# Altium schematic sheet driver2.SchDoc
size OrCAD D
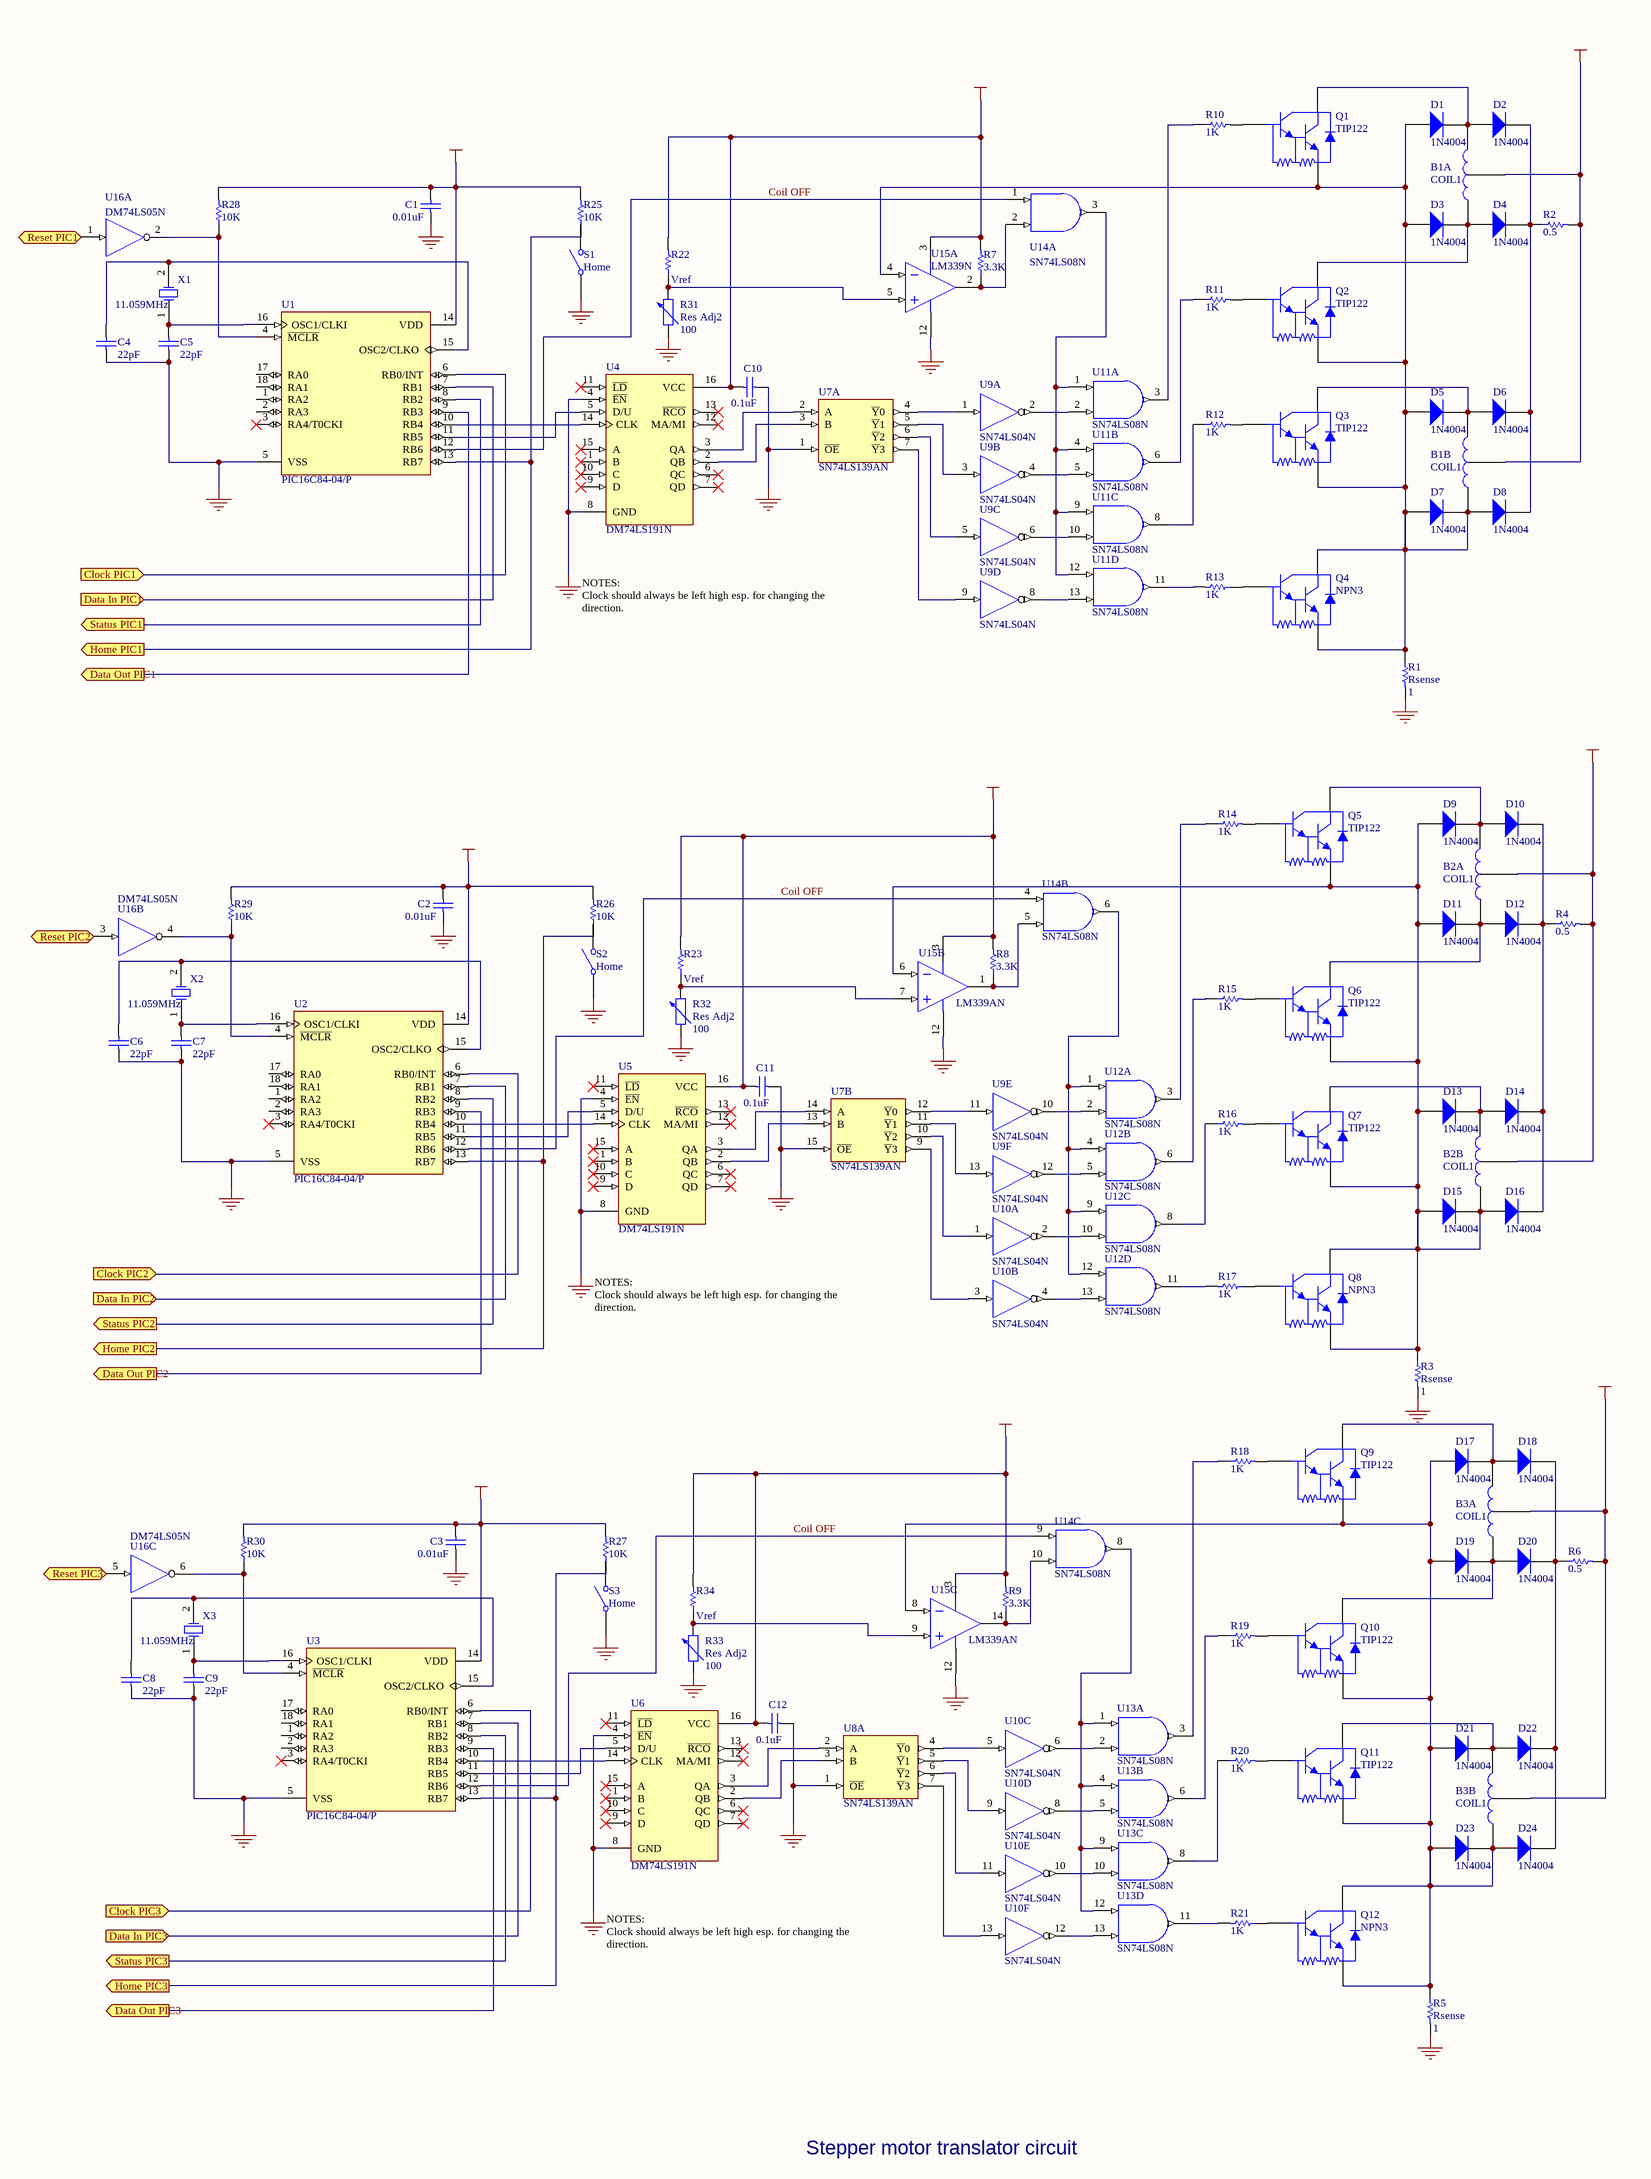
[diagram p0: driver2.SchDoc]

## Parts
(Parts that share a designator on the sheet are numbered #1, #2 ... from top to bottom, then left to right.)
B1A  COIL1
B1B  COIL1
B2A  COIL1
B2B  COIL1
B3A  COIL1
B3B  COIL1
C1  value 0.01uF  [DIP-18]  (hidden comment: PIC16C84-04/P)
C2  value 0.01uF  [DIP-18]  (hidden comment: PIC16C84-04/P)
C3  value 0.01uF  [DIP-18]  (hidden comment: PIC16C84-04/P)
C4  value 22pF  [BCY-W2/D3.1]  (hidden comment: XTAL)
C5  value 22pF  [BCY-W2/D3.1]  (hidden comment: XTAL)
C6  value 22pF  [BCY-W2/D3.1]  (hidden comment: XTAL)
C7  value 22pF  [BCY-W2/D3.1]  (hidden comment: XTAL)
C8  value 22pF  [BCY-W2/D3.1]  (hidden comment: XTAL)
C9  value 22pF  [BCY-W2/D3.1]  (hidden comment: XTAL)
C10  value 0.1uF  [DIP-14/D19.7]  (hidden comment: SN74LS08N)
C11  value 0.1uF  [DIP-14/D19.7]  (hidden comment: SN74LS08N)
C12  value 0.1uF  [DIP-14/D19.7]  (hidden comment: SN74LS08N)
D1  1N4004  [DIO10.46-5.3x2.8]
D2  1N4004  [DIO10.46-5.3x2.8]
D3  1N4004  [DIO10.46-5.3x2.8]
D4  1N4004  [DIO10.46-5.3x2.8]
D5  1N4004  [DIO10.46-5.3x2.8]
D6  1N4004  [DIO10.46-5.3x2.8]
D7  1N4004  [DIO10.46-5.3x2.8]
D8  1N4004  [DIO10.46-5.3x2.8]
D9  1N4004  [DIO10.46-5.3x2.8]
D10  1N4004  [DIO10.46-5.3x2.8]
D11  1N4004  [DIO10.46-5.3x2.8]
D12  1N4004  [DIO10.46-5.3x2.8]
D13  1N4004  [DIO10.46-5.3x2.8]
D14  1N4004  [DIO10.46-5.3x2.8]
D15  1N4004  [DIO10.46-5.3x2.8]
D16  1N4004  [DIO10.46-5.3x2.8]
D17  1N4004  [DIO10.46-5.3x2.8]
D18  1N4004  [DIO10.46-5.3x2.8]
D19  1N4004  [DIO10.46-5.3x2.8]
D20  1N4004  [DIO10.46-5.3x2.8]
D21  1N4004  [DIO10.46-5.3x2.8]
D22  1N4004  [DIO10.46-5.3x2.8]
D23  1N4004  [DIO10.46-5.3x2.8]
D24  1N4004  [DIO10.46-5.3x2.8]
Q1  TIP122  [BCY-W3]
Q2  TIP122  [BCY-W3]
Q3  TIP122  [BCY-W3]
Q4  NPN3  [BCY-W3]
Q5  TIP122  [BCY-W3]
Q6  TIP122  [BCY-W3]
Q7  TIP122  [BCY-W3]
Q8  NPN3  [BCY-W3]
Q9  TIP122  [BCY-W3]
Q10  TIP122  [BCY-W3]
Q11  TIP122  [BCY-W3]
Q12  NPN3  [BCY-W3]
R1  Rsense  value 1  [DIO10.46-5.3x2.8]
R2  value 0.5  [DIO10.46-5.3x2.8]  (hidden comment: 1N4004)
R3  Rsense  value 1  [DIO10.46-5.3x2.8]
R4  value 0.5  [DIO10.46-5.3x2.8]  (hidden comment: 1N4004)
R5  Rsense  value 1  [DIO10.46-5.3x2.8]
R6  value 0.5  [DIO10.46-5.3x2.8]  (hidden comment: 1N4004)
R7  value 3.3K  [BCY-W3]  (hidden comment: NPN3)
R8  value 3.3K  [BCY-W3]  (hidden comment: NPN3)
R9  value 3.3K  [BCY-W3]  (hidden comment: NPN3)
R10  1K  [AXIAL-0.3]
R11  value 1K  [BCY-W3]  (hidden comment: NPN3)
R12  value 1K  [BCY-W3]  (hidden comment: NPN3)
R13  value 1K  [BCY-W3]  (hidden comment: NPN3)
R14  1K  [AXIAL-0.3]
R15  value 1K  [BCY-W3]  (hidden comment: NPN3)
R16  value 1K  [BCY-W3]  (hidden comment: NPN3)
R17  value 1K  [BCY-W3]  (hidden comment: NPN3)
R18  1K  [AXIAL-0.3]
R19  value 1K  [BCY-W3]  (hidden comment: NPN3)
R20  value 1K  [BCY-W3]  (hidden comment: NPN3)
R21  value 1K  [BCY-W3]  (hidden comment: NPN3)
R22  value Vref  [SO-G14/E2]  (hidden comment: DM74LS05M)
R23  value Vref  [SO-G14/E2]  (hidden comment: DM74LS05M)
R25  value 10K  [SPST-2]  (hidden comment: SW-SPST)
R26  value 10K  [SPST-2]  (hidden comment: SW-SPST)
R27  value 10K  [SPST-2]  (hidden comment: SW-SPST)
R28  value 10K  [DIP-18]  (hidden comment: PIC16C84-04/P)
R29  value 10K  [DIP-18]  (hidden comment: PIC16C84-04/P)
R30  value 10K  [DIP-18]  (hidden comment: PIC16C84-04/P)
R31  Res Adj2  value 100  [AXIAL-0.6]
R32  Res Adj2  value 100  [AXIAL-0.6]
R33  Res Adj2  value 100  [AXIAL-0.6]
R34  value Vref  [SO-G14/E2]  (hidden comment: DM74LS05M)
S1  Home  [SPST-2]
S2  Home  [SPST-2]
S3  Home  [SPST-2]
U1  PIC16C84-04/P  [DIP-18]
U2  PIC16C84-04/P  [DIP-18]
U3  PIC16C84-04/P  [DIP-18]
U4  DM74LS191N  [DIP-16]
U5  DM74LS191N  [DIP-16]
U6  DM74LS191N  [DIP-16]
U7  SN74LS139AN  [DIP-16/X1.5]  (parts A,B of 2)
U8  SN74LS139AN  [DIP-16/X1.5]  (part A of 2)
U9  SN74LS04N  [DIP-14/D19.7]  (parts A,B,C,D,E,F of 6)
U10  SN74LS04N  [DIP-14/D19.7]  (parts A,B,C,D,E,F of 6)
U11  SN74LS08N  [DIP-14/D19.7]  (parts A,B,C,D of 4)
U12  SN74LS08N  [DIP-14/D19.7]  (parts A,B,C,D of 4)
U13  SN74LS08N  [DIP-14/D19.7]  (parts A,B,C,D of 4)
U14  SN74LS08N  [DIP-14/D19.7]  (parts A,B,C of 4)
U15#1  LM339N  [DIP-14/D19.7]  (part A of 4)
U15#2  LM339AN  [DIP-14/D19.7]  (parts B,C of 4)
U16  DM74LS05N  [DIP-14/D19.7]  (parts A,B,C of 6)
X1  11.059MHz  [BCY-W2/D3.1]
X2  11.059MHz  [BCY-W2/D3.1]
X3  11.059MHz  [BCY-W2/D3.1]

## Ports
Clock PIC1 (in), Clock PIC2 (in), Clock PIC3 (in), Data In PIC1 (in), Data In PIC2 (in), Data In PIC3 (in), Data Out PIC1 (out), Data Out PIC2 (out), Data Out PIC3 (out), Home PIC1 (out), Home PIC2 (out), Home PIC3 (out), Reset PIC1, Reset PIC2, Reset PIC3, Status PIC1 (out), Status PIC2 (out), Status PIC3 (out)

## Nets
+12V: B1A.3(Supply) B1B.3(Supply) B2A.3(Supply) B2B.3(Supply) B3A.3(Supply) B3B.3(Supply) R2.2 R4.2 R6.2
GND: C1.1 C2.1 C3.1 C4.1 C5.1 C6.1 C7.1 C8.1 C9.1 C10.1 C11.1 C12.1 R1.2 R3.2 R5.2 R31.1 R32.1 R33.1 S1.1(COMMON) S2.1(COMMON) S3.1(COMMON) U1.5(VSS) U2.5(VSS) U3.5(VSS) U4.4(~{EN}) U4.8(GND) U5.4(~{EN}) U5.8(GND) U6.4(~{EN}) U6.8(GND) U7.1(~{OE}) U7.8(GND) U7.15(~{OE}) U8.1(~{OE}) U8.8(GND) U9.7(GND) U10.7(GND) U11.7(GND) U12.7(GND) U13.7(GND) U14.7(GND) U15#1.12(GND) U15#2.12(GND) U16.7(GND)
VCC: C1.2 C2.2 C3.2 C10.2 C11.2 C12.2 R7.2 R8.2 R9.2 R22.2 R23.2 R25.2 R26.2 R27.2 R28.2 R29.2 R30.2 R34.2 U1.14(VDD) U2.14(VDD) U3.14(VDD) U4.16(VCC) U5.16(VCC) U6.16(VCC) U7.16(VCC) U8.16(VCC) U11.14(VCC) U12.14(VCC) U13.14(VCC) U14.14(VCC) U15#1.3(V+) U15#2.3(V+) U16.14(VCC)
VDD: U9.14(VDD) U10.14(VDD)
Clock PIC1: U1.6(RB0/INT) ; port Clock PIC1
Clock PIC2: U2.6(RB0/INT) ; port Clock PIC2
Clock PIC3: U3.6(RB0/INT) ; port Clock PIC3
Coil OFF: U1.12(RB6) U2.12(RB6) U3.12(RB6) U14.1(A) U14.4(A) U14.9(A)
Data In PIC1: U1.7(RB1) ; port Data In PIC1
Data In PIC2: U2.7(RB1) ; port Data In PIC2
Data In PIC3: U3.7(RB1) ; port Data In PIC3
Data Out PIC1: U1.9(RB3) ; port Data Out PIC1
Data Out PIC2: U2.9(RB3) ; port Data Out PIC2
Data Out PIC3: U3.9(RB3) ; port Data Out PIC3
Home PIC1: R25.1 U1.13(RB7) ; port Home PIC1
Home PIC2: R26.1 U2.13(RB7) ; port Home PIC2
Home PIC3: R27.1 U3.13(RB7) ; port Home PIC3
Reset PIC1: U16.1(A) ; port Reset PIC1
Reset PIC2: U16.3(A) ; port Reset PIC2
Reset PIC3: U16.5(A) ; port Reset PIC3
Status PIC1: U1.8(RB2) ; port Status PIC1
Status PIC2: U2.8(RB2) ; port Status PIC2
Status PIC3: U3.8(RB2) ; port Status PIC3
NetB1A_1: B1A.1 D3.2(K) D4.1(A) Q2.1(C)
NetB1A_2: B1A.2 D1.2(K) D2.1(A) Q1.1(C)
NetB1B_1: B1B.1 D1.1(A) D3.1(A) D5.1(A) D7.1(A) D7.2(K) D8.1(A) Q1.3(E) Q2.3(E) Q3.3(E) Q4.1(C) Q4.3(E) R1.1 U15#1.4(IN-)
NetB1B_2: B1B.2 D5.2(K) D6.1(A) Q3.1(C)
NetB2A_1: B2A.1 D11.2(K) D12.1(A) Q6.1(C)
NetB2A_2: B2A.2 D9.2(K) D10.1(A) Q5.1(C)
NetB2B_1: B2B.1 D9.1(A) D11.1(A) D13.1(A) D15.1(A) D15.2(K) D16.1(A) Q5.3(E) Q6.3(E) Q7.3(E) Q8.1(C) Q8.3(E) R3.1 U15#2.6(IN-)
NetB2B_2: B2B.2 D13.2(K) D14.1(A) Q7.1(C)
NetB3A_1: B3A.1 D19.2(K) D20.1(A) Q10.1(C)
NetB3A_2: B3A.2 D17.2(K) D18.1(A) Q9.1(C)
NetB3B_1: B3B.1 D17.1(A) D19.1(A) D21.1(A) D23.1(A) D23.2(K) D24.1(A) Q9.3(E) Q10.3(E) Q11.3(E) Q12.1(C) Q12.3(E) R5.1 U15#2.8(IN-)
NetB3B_2: B3B.2 D21.2(K) D22.1(A) Q11.1(C)
NetC4_2: C4.2 U1.15(OSC2/CLKO) X1.2(OSC2)
NetC5_2: C5.2 U1.16(OSC1/CLKI) X1.1(OSC1)
NetC6_2: C6.2 U2.15(OSC2/CLKO) X2.2(OSC2)
NetC7_2: C7.2 U2.16(OSC1/CLKI) X2.1(OSC1)
NetC8_2: C8.2 U3.15(OSC2/CLKO) X3.2(OSC2)
NetC9_2: C9.2 U3.16(OSC1/CLKI) X3.1(OSC1)
NetD2_2: D2.2(K) D4.2(K) D6.2(K) D8.2(K) R2.1
NetD10_2: D10.2(K) D12.2(K) D14.2(K) D16.2(K) R4.1
NetD18_2: D18.2(K) D20.2(K) D22.2(K) D24.2(K) R6.1
NetQ1_2: Q1.2(B) R10.2
NetQ2_2: Q2.2(B) R11.2
NetQ3_2: Q3.2(B) R12.2
NetQ4_2: Q4.2(B) R13.1
NetQ5_2: Q5.2(B) R14.2
NetQ6_2: Q6.2(B) R15.2
NetQ7_2: Q7.2(B) R16.2
NetQ8_2: Q8.2(B) R17.1
NetQ9_2: Q9.2(B) R18.2
NetQ10_2: Q10.2(B) R19.2
NetQ11_2: Q11.2(B) R20.2
NetQ12_2: Q12.2(B) R21.1
NetR7_1: R7.1 U14.2(B) U15#1.2(OUT)
NetR8_1: R8.1 U14.5(B) U15#2.1(OUT)
NetR9_1: R9.1 U14.10(B) U15#2.14(OUT)
NetR10_1: R10.1 U11.3(Y)
NetR11_1: R11.1 U11.6(Y)
NetR12_1: R12.1 U11.8(Y)
NetR13_2: R13.2 U11.11(Y)
NetR14_1: R14.1 U12.3(Y)
NetR15_1: R15.1 U12.6(Y)
NetR16_1: R16.1 U12.8(Y)
NetR17_2: R17.2 U12.11(Y)
NetR18_1: R18.1 U13.3(Y)
NetR19_1: R19.1 U13.6(Y)
NetR20_1: R20.1 U13.8(Y)
NetR21_2: R21.2 U13.11(Y)
NetR22_1: R22.1 R31.2 U15#1.5(IN+)
NetR23_1: R23.1 R32.2 U15#2.7(IN+)
NetR28_1: R28.1 U1.4(~{MCLR}) U16.2(Y)
NetR29_1: R29.1 U2.4(~{MCLR}) U16.4(Y)
NetR30_1: R30.1 U3.4(~{MCLR}) U16.6(Y)
NetR33_2: R33.2 R34.1 U15#2.9(IN+)
NetU1_10: U1.10(RB4) U4.14(CLK)
NetU1_11: U1.11(RB5) U4.5(D/U)
NetU2_10: U2.10(RB4) U5.14(CLK)
NetU2_11: U2.11(RB5) U5.5(D/U)
NetU3_10: U3.10(RB4) U6.14(CLK)
NetU3_11: U3.11(RB5) U6.5(D/U)
NetU4_2: U4.2(QB) U7.3(B)
NetU4_3: U4.3(QA) U7.2(A)
NetU5_2: U5.2(QB) U7.13(B)
NetU5_3: U5.3(QA) U7.14(A)
NetU6_2: U6.2(QB) U8.3(B)
NetU6_3: U6.3(QA) U8.2(A)
NetU7_4: U7.4(~{Y}0) U9.1(IN)
NetU7_5: U7.5(~{Y}1) U9.3(IN)
NetU7_6: U7.6(~{Y}2) U9.5(IN)
NetU7_7: U7.7(~{Y}3) U9.9(IN)
NetU7_9: U7.9(~{Y}3) U10.3(IN)
NetU7_10: U7.10(~{Y}2) U10.1(IN)
NetU7_11: U7.11(~{Y}1) U9.13(IN)
NetU7_12: U7.12(~{Y}0) U9.11(IN)
NetU8_4: U8.4(~{Y}0) U10.5(IN)
NetU8_5: U8.5(~{Y}1) U10.9(IN)
NetU8_6: U8.6(~{Y}2) U10.11(IN)
NetU8_7: U8.7(~{Y}3) U10.13(IN)
NetU9_2: U9.2(~{OUT}) U11.2(B)
NetU9_4: U9.4(~{OUT}) U11.5(B)
NetU9_6: U9.6(~{OUT}) U11.10(B)
NetU9_8: U9.8(~{OUT}) U11.13(B)
NetU9_10: U9.10(~{OUT}) U12.2(B)
NetU9_12: U9.12(~{OUT}) U12.5(B)
NetU10_2: U10.2(~{OUT}) U12.10(B)
NetU10_4: U10.4(~{OUT}) U12.13(B)
NetU10_6: U10.6(~{OUT}) U13.2(B)
NetU10_8: U10.8(~{OUT}) U13.5(B)
NetU10_10: U10.10(~{OUT}) U13.10(B)
NetU10_12: U10.12(~{OUT}) U13.13(B)
NetU11_1: U11.1(A) U11.4(A) U11.9(A) U11.12(A) U14.3(Y)
NetU12_1: U12.1(A) U12.4(A) U12.9(A) U12.12(A) U14.6(Y)
NetU13_1: U13.1(A) U13.4(A) U13.9(A) U13.12(A) U14.8(Y)

Not connected (* = marked no-connect by the designer): S1 2(NO); S2 2(NO); S3 2(NO); U1 1(RA2) 2(RA3) 3(RA4/T0CKI)* 17(RA0) 18(RA1); U2 1(RA2) 2(RA3) 3(RA4/T0CKI)* 17(RA0) 18(RA1); U3 1(RA2) 2(RA3) 3(RA4/T0CKI)* 17(RA0) 18(RA1); U4 1(B)* 6(QC)* 7(QD)* 9(D)* 10(C)* 11(~{LD})* 12(MA/MI)* 13(~{RCO})* 15(A)*; U5 1(B)* 6(QC)* 7(QD)* 9(D)* 10(C)* 11(~{LD})* 12(MA/MI)* 13(~{RCO})* 15(A)*; U6 1(B)* 6(QC)* 7(QD)* 9(D)* 10(C)* 11(~{LD})* 12(MA/MI)* 13(~{RCO})* 15(A)*

## Notes on the sheet
- NOTES:
  Clock should always be left high esp. for changing the direction.
- Stepper motor translator circuit

## Library data of the parts
B1A B1B B2A B2B B3A B3B = Component_1
C1-C12 = cap: Capacitor; Manufacturer: Generic Components; Class I: Passive; Published: 8-Jun-2000; Revision: July-2002: Re-released for DXP Platform.; Publisher: Altium Limited; Class II: Capacitor
D1-D24 = 1N4004: 1.0 Ampere General Purpose Rectifier; Manufacturer: Fairchild Semiconductor; Revision 1: 11-July-2000: SIM Model Added.; Revision 2: July-2002: Re-released for DXP Platform.; Package Information: Latest Revision: Aug-1999; Class I: Discrete; Class II: Rectifier - Standard Recovery; Published: 8-Jun-2000; Datasheet: Latest Revision: 1998; Package Reference: DO-41; Publisher: Altium Limited
Q1-Q12 = NPN3: NPN Darlington Bipolar Transistor; Manufacturer: Generic Components; Class I: Discrete; Class II: BJT - Darlington; Published: 8-Jun-2000; Revision: July-2002: Re-released for DXP Platform.; Publisher: Altium Limited
R1-R9 R11-R13 R15-R17 R19-R23 R25-R30 R34 = res1: Resistor; Manufacturer: Generic Components; Class I: Passive; Published: 8-Jun-2000; Revision: July-2002: Re-released for DXP Platform.; Publisher: Altium Limited; Class II: Resistor
R10 R14 R18 = Res1: Resistor; Manufacturer: Generic Components; Class I: Passive; Published: 8-Jun-2000; Publisher: Altium Limited; Class II: Resistor; Revision: July-2002: Re-released for DXP Platform.; Value: 1K
R31-R33 = Res Adj2: Variable Resistor; Manufacturer: Generic Components; Class I: Passive; Set Position: 0.5; Published: 8-Jun-2000; Revision: July-2002: Re-released for DXP Platform.; Publisher: Altium Limited; Class II: Resistor
S1-S3 = SW-SPST: Single-Pole, Single-Throw Switch; Manufacturer: Generic Components; Published: 24-Mar-1999; Revision: July-2002: Re-released for DXP Platform.; Publisher: Altium Limited
U1-U3 = PIC16C84-04/P: EPROM-Based 8-Bit CMOS Microcontroller; Manufacturer: Microchip; Published: 8-Jun-2000; Revision: July-2002: Re-released for DXP Platform.; Datasheet: 1997 Technical Library CD (1996); Package Reference: P18A; Publisher: Altium Limited; Class I: Microcontroller; Class II: 8-bit
U4-U6 = DM74LS191N: Synchronous 4-Bit Up/Down Counter with Mode Control; Manufacturer: National Semiconductor; Class I: Logic; Published: 15-Apr-2002; Datasheet: Latest Revision: May-1989; Package Reference: N16E; Publisher: Altium Limited; Class II: Counter
U7 U8 = SN74LS139AN: Dual 2-Line to 4-Line Decoder / Demultiplexer; Manufacturer: Texas Instruments; Revision 1: 12-July-2000: SIM Model Added.; Revision 2: July-2002: Re-released for DXP Platform.; Class I: Logic; Published: 8-Jun-2000; Datasheet: Latest Revision: Mar-1988; Package Reference: N016; Publisher: Altium Limited; Class II: Decoder/Demultiplexer
U9 U10 = SN74LS04N: Hex Inverter; Manufacturer: ON Semiconductor; Class I: Logic; Class II: Buffer/Line Driver; Published: 15-Apr-2002; Datasheet: Latest Revision: 1999; Package Reference: 646-06; Publisher: Altium Limited
U11-U14 = SN74LS08N: Quadruple 2-Input Positive-AND Gate; Manufacturer: Texas Instruments; Class I: Logic; Published: 8-Jun-2000; Revision: July-2002: Re-released for DXP Platform.; Datasheet: Latest Revision: Mar-1988; Package Reference: N014; Publisher: Altium Limited; Class II: Gate
U15#1 = LM339N: Quad Single-Supply Comparator; Manufacturer: Motorola; Class I: Analog; Published: 15-Apr-2002; Datasheet: Linear and Interface Integrated Circuits, DL128 Rev2 (1988); Package Reference: 646-06; Publisher: Altium Limited; Class II: Comparator
U15#2 = LM339AN: Quad Single-Supply Comparator; Manufacturer: Motorola; Class I: Analog; Published: 15-Apr-2002; Datasheet: Linear and Interface Integrated Circuits, DL128 Rev2 (1988); Package Reference: 646-06; Publisher: Altium Limited; Class II: Comparator
U16 = DM74LS05N: Hex Inverter with Open-Collector Output; Manufacturer: Fairchild Semiconductor; Class I: Logic; Class II: Gate; Published: 15-Apr-2002; Datasheet: Latest Revision: Mar-1998; Package Reference: N14A; Publisher: Altium Limited
X1-X3 = XTAL: Crystal Oscillator; Manufacturer: Generic Components; Published: 8-Jun-2000; Revision: July-2002: Re-released for DXP Platform.; Publisher: Altium Limited; Class I: Oscillator; Class II: Crystal Oscillator